# Altium schematic sheet SH3 - LEVEL SHIFTER.SchDoc: Level Shifter
size B; CheckedBy: Lance Bantoto; Engineer: Wolfgang Windholtz; Organization: UW Robotics; Address1: 200 University Avenue; Address2: Waterloo; Address3: Ontario; Address4: Canada N2L 3G6; Revision: 2; SheetNumber: 3; SheetTotal: 5
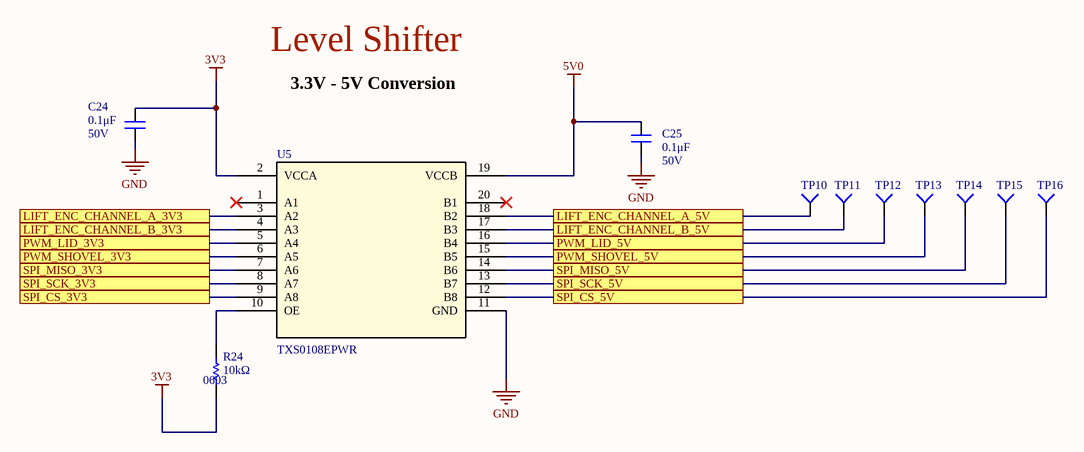
[diagram p0: SH3 - LEVEL SHIFTER.SchDoc]

## Parts
C24  value 0.1μF  Voltage Rating: 50V  [CAP0603]  (hidden comment: CAP_0.1uF_50V_0603)
C25  value 0.1μF  Voltage Rating: 50V  [CAP0603]  (hidden comment: CAP_0.1uF_50V_0603)
R24  value 10kΩ  Package/Footprint: 0603  [RESC0603]  (hidden comment: RES_10kΩ_0603_5%)
TP10  TESTPOINT_1MM_CIRCLE  [TESTPOINT_CIRCLE_1MM]  (value not drawn)  (no BOM)
TP11  TESTPOINT_1MM_CIRCLE  [TESTPOINT_CIRCLE_1MM]  (value not drawn)  (no BOM)
TP12  TESTPOINT_1MM_CIRCLE  [TESTPOINT_CIRCLE_1MM]  (value not drawn)  (no BOM)
TP13  TESTPOINT_1MM_CIRCLE  [TESTPOINT_CIRCLE_1MM]  (value not drawn)  (no BOM)
TP14  TESTPOINT_1MM_CIRCLE  [TESTPOINT_CIRCLE_1MM]  (value not drawn)  (no BOM)
TP15  TESTPOINT_1MM_CIRCLE  [TESTPOINT_CIRCLE_1MM]  (value not drawn)  (no BOM)
TP16  TESTPOINT_1MM_CIRCLE  [TESTPOINT_CIRCLE_1MM]  (value not drawn)  (no BOM)
U5  Manufacturer Part Number 1: TXS0108EPWR  [LEVEL_SHIFTER_8_CHANNEL]  (hidden comment: IC_LVL_SHIFTER_8_CH)

## Ports
LIFT_ENC_CHANNEL_A_3V3, LIFT_ENC_CHANNEL_A_5V, LIFT_ENC_CHANNEL_B_3V3, LIFT_ENC_CHANNEL_B_5V, PWM_LID_3V3, PWM_LID_5V, PWM_SHOVEL_3V3, PWM_SHOVEL_5V, SPI_CS_3V3, SPI_CS_5V, SPI_MISO_3V3, SPI_MISO_5V, SPI_SCK_3V3, SPI_SCK_5V

## Nets
3V3: C24.2 R24.1 U5.2(VCCA)
5V0: C25.2 U5.19(VCCB)
GND: C24.1 C25.1 U5.11(GND)
LIFT_ENC_CHANNEL_A_3V3: U5.3(A2) ; port LIFT_ENC_CHANNEL_A_3V3
LIFT_ENC_CHANNEL_A_5V: TP10.1(=value) U5.18(B2) ; port LIFT_ENC_CHANNEL_A_5V
LIFT_ENC_CHANNEL_B_3V3: U5.4(A3) ; port LIFT_ENC_CHANNEL_B_3V3
LIFT_ENC_CHANNEL_B_5V: TP11.1(=value) U5.17(B3) ; port LIFT_ENC_CHANNEL_B_5V
PWM_LID_3V3: U5.5(A4) ; port PWM_LID_3V3
PWM_LID_5V: TP12.1(=value) U5.16(B4) ; port PWM_LID_5V
PWM_SHOVEL_3V3: U5.6(A5) ; port PWM_SHOVEL_3V3
PWM_SHOVEL_5V: TP13.1(=value) U5.15(B5) ; port PWM_SHOVEL_5V
SPI_CS_3V3: U5.9(A8) ; port SPI_CS_3V3
SPI_CS_5V: TP16.1(=value) U5.12(B8) ; port SPI_CS_5V
SPI_MISO_3V3: U5.7(A6) ; port SPI_MISO_3V3
SPI_MISO_5V: TP14.1(=value) U5.14(B6) ; port SPI_MISO_5V
SPI_SCK_3V3: U5.8(A7) ; port SPI_SCK_3V3
SPI_SCK_5V: TP15.1(=value) U5.13(B7) ; port SPI_SCK_5V
NetR24_2: R24.2 U5.10(OE)

Not connected (* = marked no-connect by the designer): U5 1(A1)* 20(B1)*

## Notes on the sheet
- Level Shifter
- 3.3V - 5V Conversion
- Title:
- Project:
- Date:
- Rev:
- Checker:
- Engineer:
- Sheet:
- of

## Library data of the parts
C24 C25 = CAP_0.1uF_50V_0603: CAP CER 0.1UF 50V X7R 0603; Manufacturer 1: Yageo; Manufacturer Part Number 1: CC0603KRX7R9BB104; Package/Footprint: 0603; Supplier 1: Digi-Key; Dielectric: X7R; Supplier Part Number 1: 311-1344-1-ND; Temperature Coefficient: X7R; Mounting Type: SMD
R24 = RES_10kΩ_0603_5%: RES 10K OHM 5% 1/10W 0603; Manufacturer 1: Yageo; Manufacturer Part Number 1: RC0603JR-0710KL; Supplier 1: Digi-Key; Case Code (Metric): 1608; Tolerance: 5%; Supplier Part Number 1: 311-10KGRCT-ND; Package: 0603 (1608 Metric); Mounting Type: SMD
TP10-TP16 = TESTPOINT_1MM_CIRCLE: TESTPOINT 1MM CIRCLE; Part Number (MPN): *
U5 = IC_LVL_SHIFTER_8_CH: IC BIDIRECTIONAL LEVEL SHIFTER 8 CHANNEL 20TSSOP; Manufacturer 1: Texas Instruments; Package/Footprint: 20-TSSOP; ComponentLink1Description: New link; ComponentLink1URL: *; Supplier 1: Digi-Key; Supplier Part Number 1: 296-23011-1-ND; Mounting Type: SMD